# Altium schematic sheet MOSFET_IRLML0030.SchDoc: Low Power MOSFET
size A4; Author: Nikola Rašević; Organization: Memristor Robotics
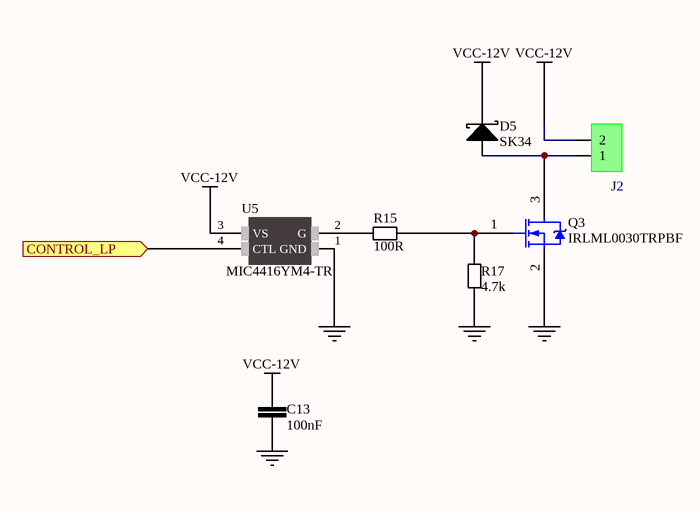
[diagram p0: MOSFET_IRLML0030.SchDoc]

## Parts
C13  100nF  [CER_0805]
D5  SK34  [DO214AC]
J2  282834-2  [CONNECTOR_282834-2]  (value not drawn)
Q3  IRLML0030TRPBF  [SOT-23]
R15  100R  [RESC2013X38N-0805-NOOVERLAY]
R17  4.7k  [RESC2013X38N-0805-NOOVERLAY]
U5  MIC4416YM4-TR  [SOT143-4]

## Ports
CONTROL_LP (in)

## Nets
GND: C13.1 Q3.2(D) R17.1 U5.1(GND)
VCC-12V: C13.2 D5.1(Cathode) J2.2 U5.3(VS)
CONTROL_LP: U5.4(CTL) ; port CONTROL_LP
NetD5_2: D5.2(Anode) J2.1 Q3.3(S)
NetQ3_1: Q3.1(G) R15.2 R17.2
NetR15_1: R15.1 U5.2(G)

## Notes on the sheet
- Title
- Date:
- Design Engineer:
- Time:
- Revision:
- Sheet
- of
- Size:
- A4
- www.memristor-robotics.io
- File:

## Library data of the parts
C13 = 00002105: CAP CER 100n 50V X7R 10% 0805; Capacitance: 100nF
D5 = SK34: DIODE SCHOTTKY 40V 3A DO214AC; Manufacturer: Vishay Semiconductor Diodes Division; Barcode: 0100000007488; id: 62; Assembly: SMD; Speed: Fast Recovery =< 500ns, > 200mA (Io); Voltage  Forward: 550mV @ 3A; item_id: 1025; Recommended Rating: Silver; Manufacturer Part Number: SK34; Category: Discrete Semiconductor Products; Datasheet URL: http://www.vishay.com/docs/88896/b330la.pdf; Package Case: DO-214AC, SMA; Family: DIODE; Voltage  DC Reverse: 40V; Current  Average Rectified: 3A; Diode Type: Schottky; Part Type: Discrete Semiconductors
J2 = TE 282834-2: Wire-To-Board Terminal Block, 2, 150 V, 10 A, 30 Awg, 16 Awg, 1.4 Mm; Number_of_Positions: 2; MF: TE Connectivity; Centerline_Pitch: 2.54 mm[.1 in]; MP: 282834-2; TE_purchase_URL: https://www.te.com/usa-en/product-282834-2.html?te_bu=Cor&te_type=disp&te_campaign=seda_glo_cor-seda-global-disp-prtnr-fy19-seda-model-bom-cta_sma-317_1&elqCampaignId=32493; Digi-Key_Purchase_URL: https://www.digikey.rs/product-detail/en/te-connectivity-amp-connectors/282834-2/A98333-ND/1150135?utm_source=snapeda&utm_medium=aggregator&utm_campaign=symbol; SnapEDA_Link: https://www.snapeda.com/parts/282834-2/TE%20Connectivity%20AMP%20Connectors/view-part/431057/?ref=snap; EU_RoHS_Compliance: Compliant with Exemptions; Digi-Key_Part_Number: A98333-ND; Package: None; Value: *
Q3 = IRLML0030: N-MOS; Manufacturer: INFINEON; Manufacturer Part Number: IRLML0030TRPBF; Order Code: IRLML0030; Package: SOT-23; Price: 0.11; Supplier: Comet.rs
R15 = 00001000: RES SMD 100 Ohm 1/8W 0805; Power: 0.125W, 1/8W; Resistance: 100R; Assembly: SMD; Barcode: 00001000
R17 = 00004701: RES SMD 4.7 kOhm 1/8W 0805; Power: 0.125W, 1/8W; Resistance: 4.7k; Assembly: SMD; Barcode: 00004701
U5 = MIC4416: IC DRIVER MOSF LOW SIDE SOT143-4; Assembly: SMD; Manufacturer Part Number: MIC4416YM4-TR; Datasheet Link: http://ww1.microchip.com/downloads/en/DeviceDoc/mic4416.pdf; Category: Integrated Circuits (ICs); Package: SOT-143; Family: MOSFET Driver; Product Page Farnell: http://uk.farnell.com/microchip/mic4416ym4-tr/driver-mosfet-low-side-smd-4416/dp/2510112